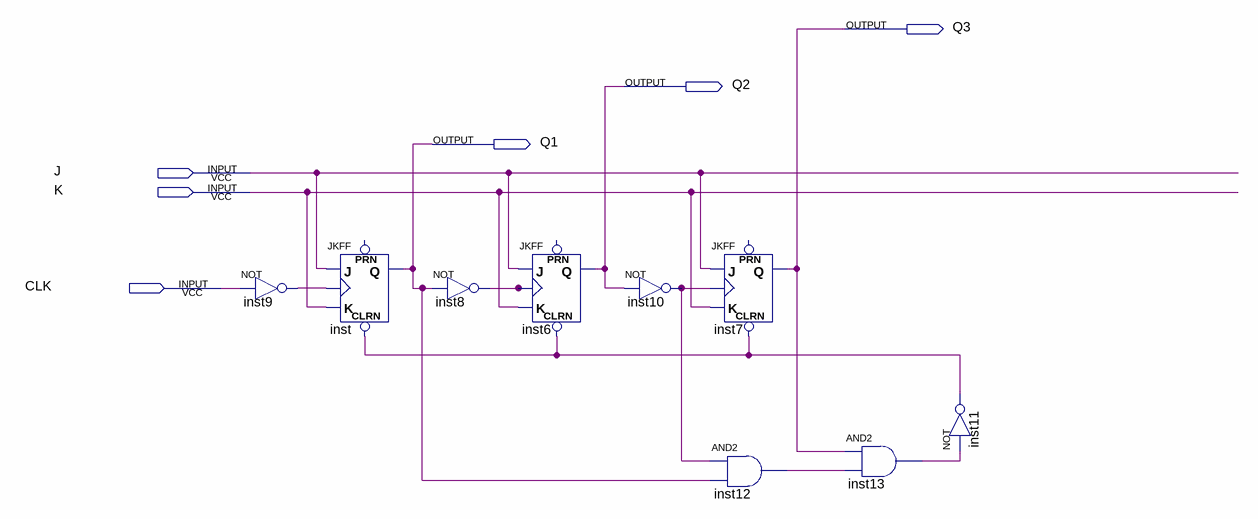
[diagram p0: schematic sheet]
// Quartus schematic Block1.bdf as structural Verilog: 9 symbols, 6 pins
module Block1 (
  input  J,
  input  K,
  input  CLK,
  output Q3,
  output Q2,
  output Q1
);

  wire inst8_out, inst9_out, inst10_out, inst11_out, inst12_out, inst13_out;

  not inst9 (inst9_out, CLK);
  JKFF inst (.CLRN(inst11_out), .K(K), .J(J), .CLK(inst9_out), .Q(Q1));  // open: PRN
  not inst8 (inst8_out, Q1);
  JKFF inst6 (.CLRN(inst11_out), .K(K), .J(J), .CLK(inst8_out), .Q(Q2));  // open: PRN
  not inst10 (inst10_out, Q2);
  JKFF inst7 (.CLRN(inst11_out), .K(K), .J(J), .CLK(inst10_out), .Q(Q3));  // open: PRN
  and inst12 (inst12_out, inst10_out, Q1);
  and inst13 (inst13_out, Q3, inst12_out);
  not inst11 (inst11_out, inst13_out);
endmodule
